# Altium schematic sheet Mounting_PCB_B.SchDoc
size A4
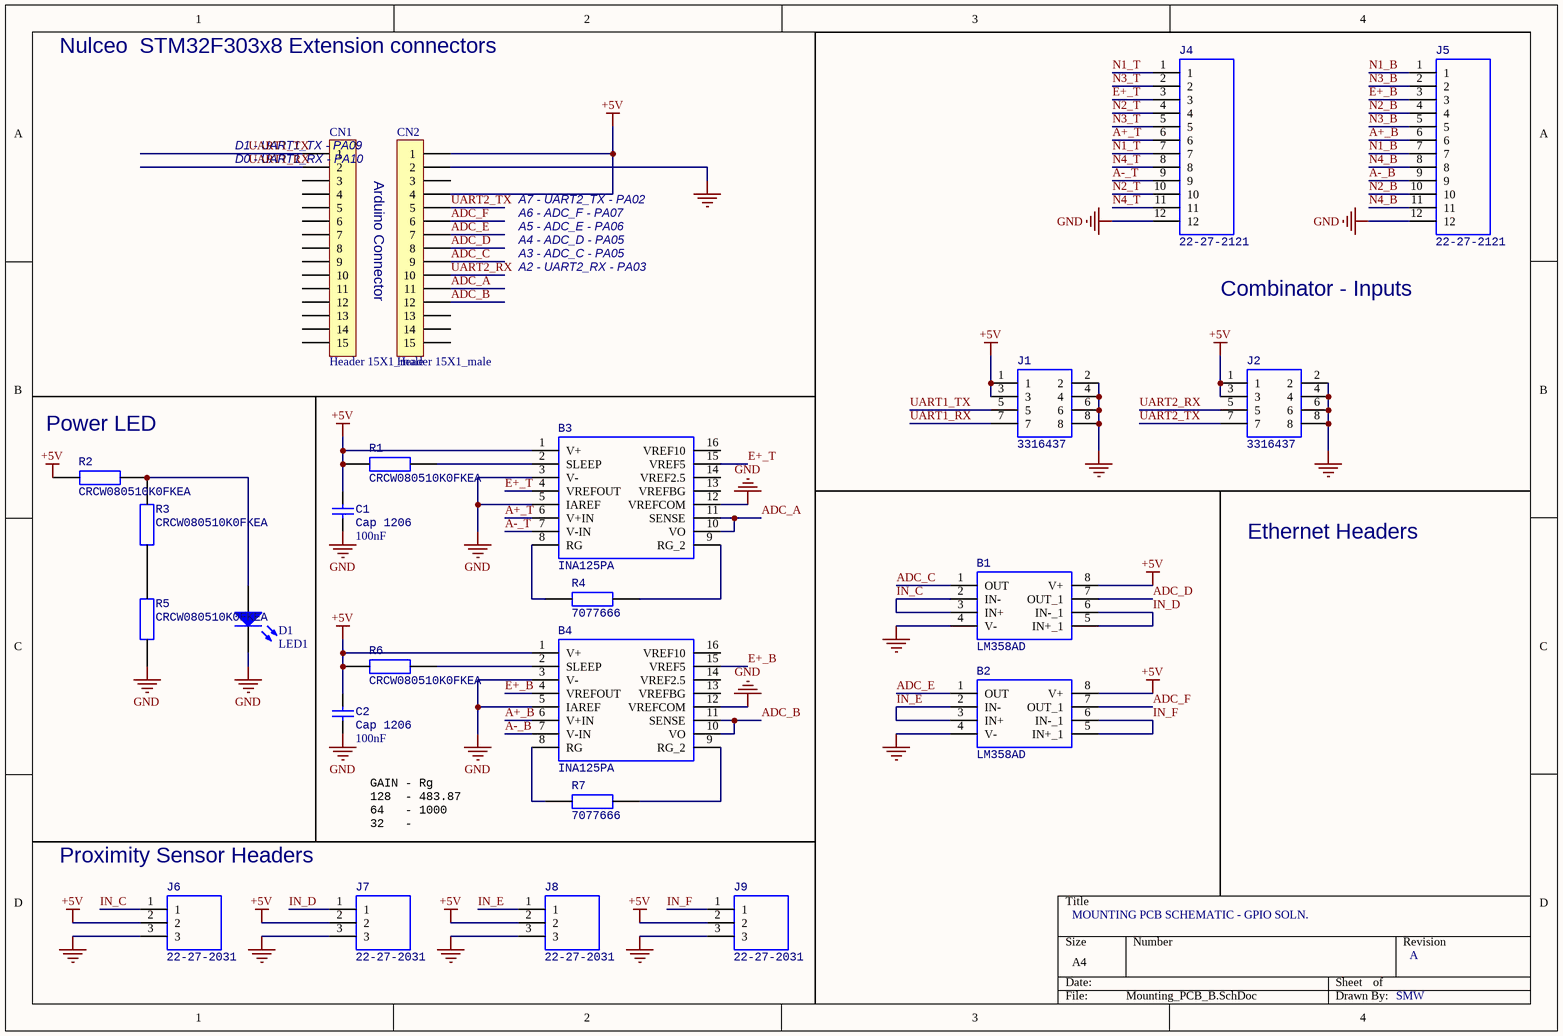
[diagram p0: Mounting_PCB_B.SchDoc]

## Parts
B1  LM358AD  [SOIC127P600X175-8N]
B2  LM358AD  [SOIC127P600X175-8N]
B3  INA125PA  [DIP254P762X508-16]
B4  INA125PA  [DIP254P762X508-16]
C1  Cap 1206  value 100nF  [C1206]
C2  Cap 1206  value 100nF  [C1206]
CN1  Header 15X1_male  [HDR_1x15_2R54_V_F]
CN2  Header 15X1_male  [HDR_1x15_2R54_V_F]
D1  LED1  [L0603]
J1  3316437  [3316437]
J2  3316437  [3316437]
J4  22-27-2121  [HDRV12W64P0X254_1X12_3048X580X1170P]
J5  22-27-2121  [HDRV12W64P0X254_1X12_3048X580X1170P]
J6  22-27-2031  [SHDR3W64P0X254_1X3_762X580X1170P]
J7  22-27-2031  [SHDR3W64P0X254_1X3_762X580X1170P]
J8  22-27-2031  [SHDR3W64P0X254_1X3_762X580X1170P]
J9  22-27-2031  [SHDR3W64P0X254_1X3_762X580X1170P]
R1  CRCW080510K0FKEA  [RESC2012X50N]
R2  CRCW080510K0FKEA  [RESC2012X50N]
R3  CRCW080510K0FKEA  [RESC2012X50N]
R4  7077666  [RESAD1550W58L630D230]
R5  CRCW080510K0FKEA  [RESC2012X50N]
R6  CRCW080510K0FKEA  [RESC2012X50N]
R7  7077666  [RESAD1550W58L630D230]

## Nets
+5V: B1.8(V+) B2.8(V+) B3.1(V+) B4.1(V+) C1.2 C2.2 CN2.1 CN2.4 J1.1 J1.3 J2.1 J2.3 J6.2 J7.2 J8.2 J9.2 R1.1 R2.1 R6.1
GND: B1.4(V-) B2.4(V-) B3.3(V-) B3.5(IAREF) B3.12(VREFCOM) B4.3(V-) B4.5(IAREF) B4.12(VREFCOM) C1.1 C2.1 CN2.2 D1.2(K) J1.2 J1.4 J1.6 J1.8 J2.2 J2.4 J2.6 J2.8 J4.12 J5.12 J6.3 J7.3 J8.3 J9.3 R5.1
A+_B: B4.6(V+IN) J5.6
A+_T: B3.6(V+IN) J4.6
A-_B: B4.7(V-IN) J5.9
A-_T: B3.7(V-IN) J4.9
ADC_A: B3.10(VO) B3.11(SENSE) CN2.11
ADC_B: B4.10(VO) B4.11(SENSE) CN2.12
ADC_C: B1.1(OUT) CN2.9
ADC_D: B1.7(OUT_1) CN2.8
ADC_E: B2.1(OUT) CN2.7
ADC_F: B2.7(OUT_1) CN2.6
E+_B: B4.4(VREFOUT) B4.15(VREF5) J5.3
E+_T: B3.4(VREFOUT) B3.15(VREF5) J4.3
IN_C: B1.2(IN-) B1.3(IN+) J6.1
IN_D: B1.5(IN+_1) B1.6(IN-_1) J7.1
IN_E: B2.2(IN-) B2.3(IN+) J8.1
IN_F: B2.5(IN+_1) B2.6(IN-_1) J9.1
N1_B: J5.1 J5.7
N1_T: J4.1 J4.7
N2_B: J5.4 J5.10
N2_T: J4.4 J4.10
N3_B: J5.2 J5.5
N3_T: J4.2 J4.5
N4_B: J5.8 J5.11
N4_T: J4.8 J4.11
UART1_RX: CN1.2 J1.7
UART1_TX: CN1.1 J1.5
UART2_RX: CN2.10 J2.5
UART2_TX: CN2.5 J2.7
NetB3_2: B3.2(SLEEP) R1.2
NetB3_8: B3.8(RG) R4.1
NetB3_9: B3.9(RG_2) R4.2
NetB4_2: B4.2(SLEEP) R6.2
NetB4_8: B4.8(RG) R7.1
NetB4_9: B4.9(RG_2) R7.2
NetD1_1: D1.1(A) R2.2 R3.2
NetR3_1: R3.1 R5.2

Not connected (* = marked no-connect by the designer): B3 13(VREFBG) 14(VREF2.5) 16(VREF10); B4 13(VREFBG) 14(VREF2.5) 16(VREF10); CN1 3 4 5 6 7 8 9 10 11 12 13 14 15; CN2 3 13 14 15

## Notes on the sheet
- Nulceo  STM32F303x8 Extension connectors
- D1 - UART1_TX - PA09
- D0 - UART1_RX - PA10
- Arduino Connector
- A4 - ADC_D - PA05
- A5 - ADC_E - PA06
- A6 - ADC_F - PA07
- A7 - UART2_TX - PA02
- A2 - UART2_RX - PA03
- A3 - ADC_C - PA05
- Combinator - Inputs
- (near R2) Power LED
- Ethernet Headers
- Proximity Sensor Headers
- GAIN - Rg
  128  - 483.87
  64   - 1000
  32   - 2142.85
- MOUNTING PCB SCHEMATIC - GPIO SOLN.
- A
- SMW

## Library data of the parts
B1 B2 = LM358AD: LM358AD, Dual Operational Amplifier 1.1MHz 5 to 28V, 8-Pin SO; Manufacturer_Name: STMicroelectronics; Geometry.Height: 1.75mm; RS Part Number: 1657542; Manufacturer_Part_Number: LM358AD; Datasheet Link: http://uk.rs-online.com/web/p/products/1657542
B3 B4 = INA125PA: Instrumentation Amplifier with Precision Voltage Reference; Manufacturer_Name: Texas Instruments; RS Part Number: 2521593P; Manufacturer_Part_Number: INA125PA; Datasheet Link: http://uk.rs-online.com/web/p/products/2521593P
C1 C2 = Cap Semi: Capacitor (Semiconductor SIM Model); Published: 8-Jun-2000; LatestRevisionDate: 29-May-2009; LatestRevisionNote: IPC-7351 Footprint Added.; PackageReference: C1206; Publisher: Altium Limited; PackageDescription: Chip Capacitor
CN1 CN2 = Header 15X1_Female_1: Header, 10-Pin, Single row,female; LatestRevisionDate: 17-Jul-2002; LatestRevisionNote: Re-released for DXP Platform.; Publisher: Altium Limited
D1 = LED1: Typical RED GaAs LED; Published: 8-Jun-2000; LatestRevisionDate: 08-Jul-2005; LatestRevisionNote: Mech Layer 1 removed.; PackageReference: LED-1; Publisher: Altium Limited; PackageDescription: LED; 2 Leads
J1 J2 = 3316437: 8/8 way r/a PCB lowprofile data skt,1.5A RS Pro Female Cat5 RJ45 Connector, Unshielded, Right Angle, PCB Mount Mount,; Manufacturer_Name: RS Components; Allied_Number: 70643325; RS Part Number: 3316437; Manufacturer_Part_Number: 3316437; Datasheet Link: http://uk.rs-online.com/web/p/products/3316437
J4 J5 = 22-27-2121: 12way straightPCB header w/friction lock Molex KK Series, Series Number 6410, 2.54mm Pitch 12 Way 1 Row Straight PCB Header, Solder Termination, 4A; Allied_Number: 70373056; Geometry.Height: 11.7mm; RS Part Number: 1707108; Manufacturer_Name: Molex; Manufacturer_Part_Number: 22-27-2121; Datasheet Link: http://uk.rs-online.com/web/p/products/1707108
J6-J9 = 22-27-2031: 3way straight PCB header w/friction lock Molex KK Series, Series Number 6410, 2.54mm Pitch 3 Way 1 Row Straight PCB Header, Solder Termination, 4A; Allied_Number: 70190935; Geometry.Height: 11.7mm; RS Part Number: 1707102; Manufacturer_Name: Molex; Manufacturer_Part_Number: 22-27-2031; Datasheet Link: http://uk.rs-online.com/web/p/products/1707102
R1-R3 R5 R6 = CRCW080510K0FKEA: CRCW0805 Resistor T/R 0.125W,1%,10K Vishay CRCW Series Thick Film Surface Mount Resistor 0805 Case 10k 1% 0.125W 100ppm/C; Allied_Number: 70203987; Geometry.Height: 0.5mm; RS Part Number: 1694499; Manufacturer_Name: Vishay; Manufacturer_Part_Number: CRCW080510K0FKEA; Datasheet Link: http://uk.rs-online.com/web/p/products/1694499
R4 R7 = 7077666: RS Pro RS Series Axial Carbon Resistor 1k 5% 0.25W -500  +350ppm/C; Manufacturer_Name: RS Components; RS Part Number: 7077666; Manufacturer_Part_Number: 7077666; Datasheet Link: https://componentsearchengine.com/Datasheets/3/7077666.pdf